# Altium schematic sheet 12_RS485_R232.SchDoc
size 420 x 297 mm; SheetNumber: 12; SheetTotal: 27
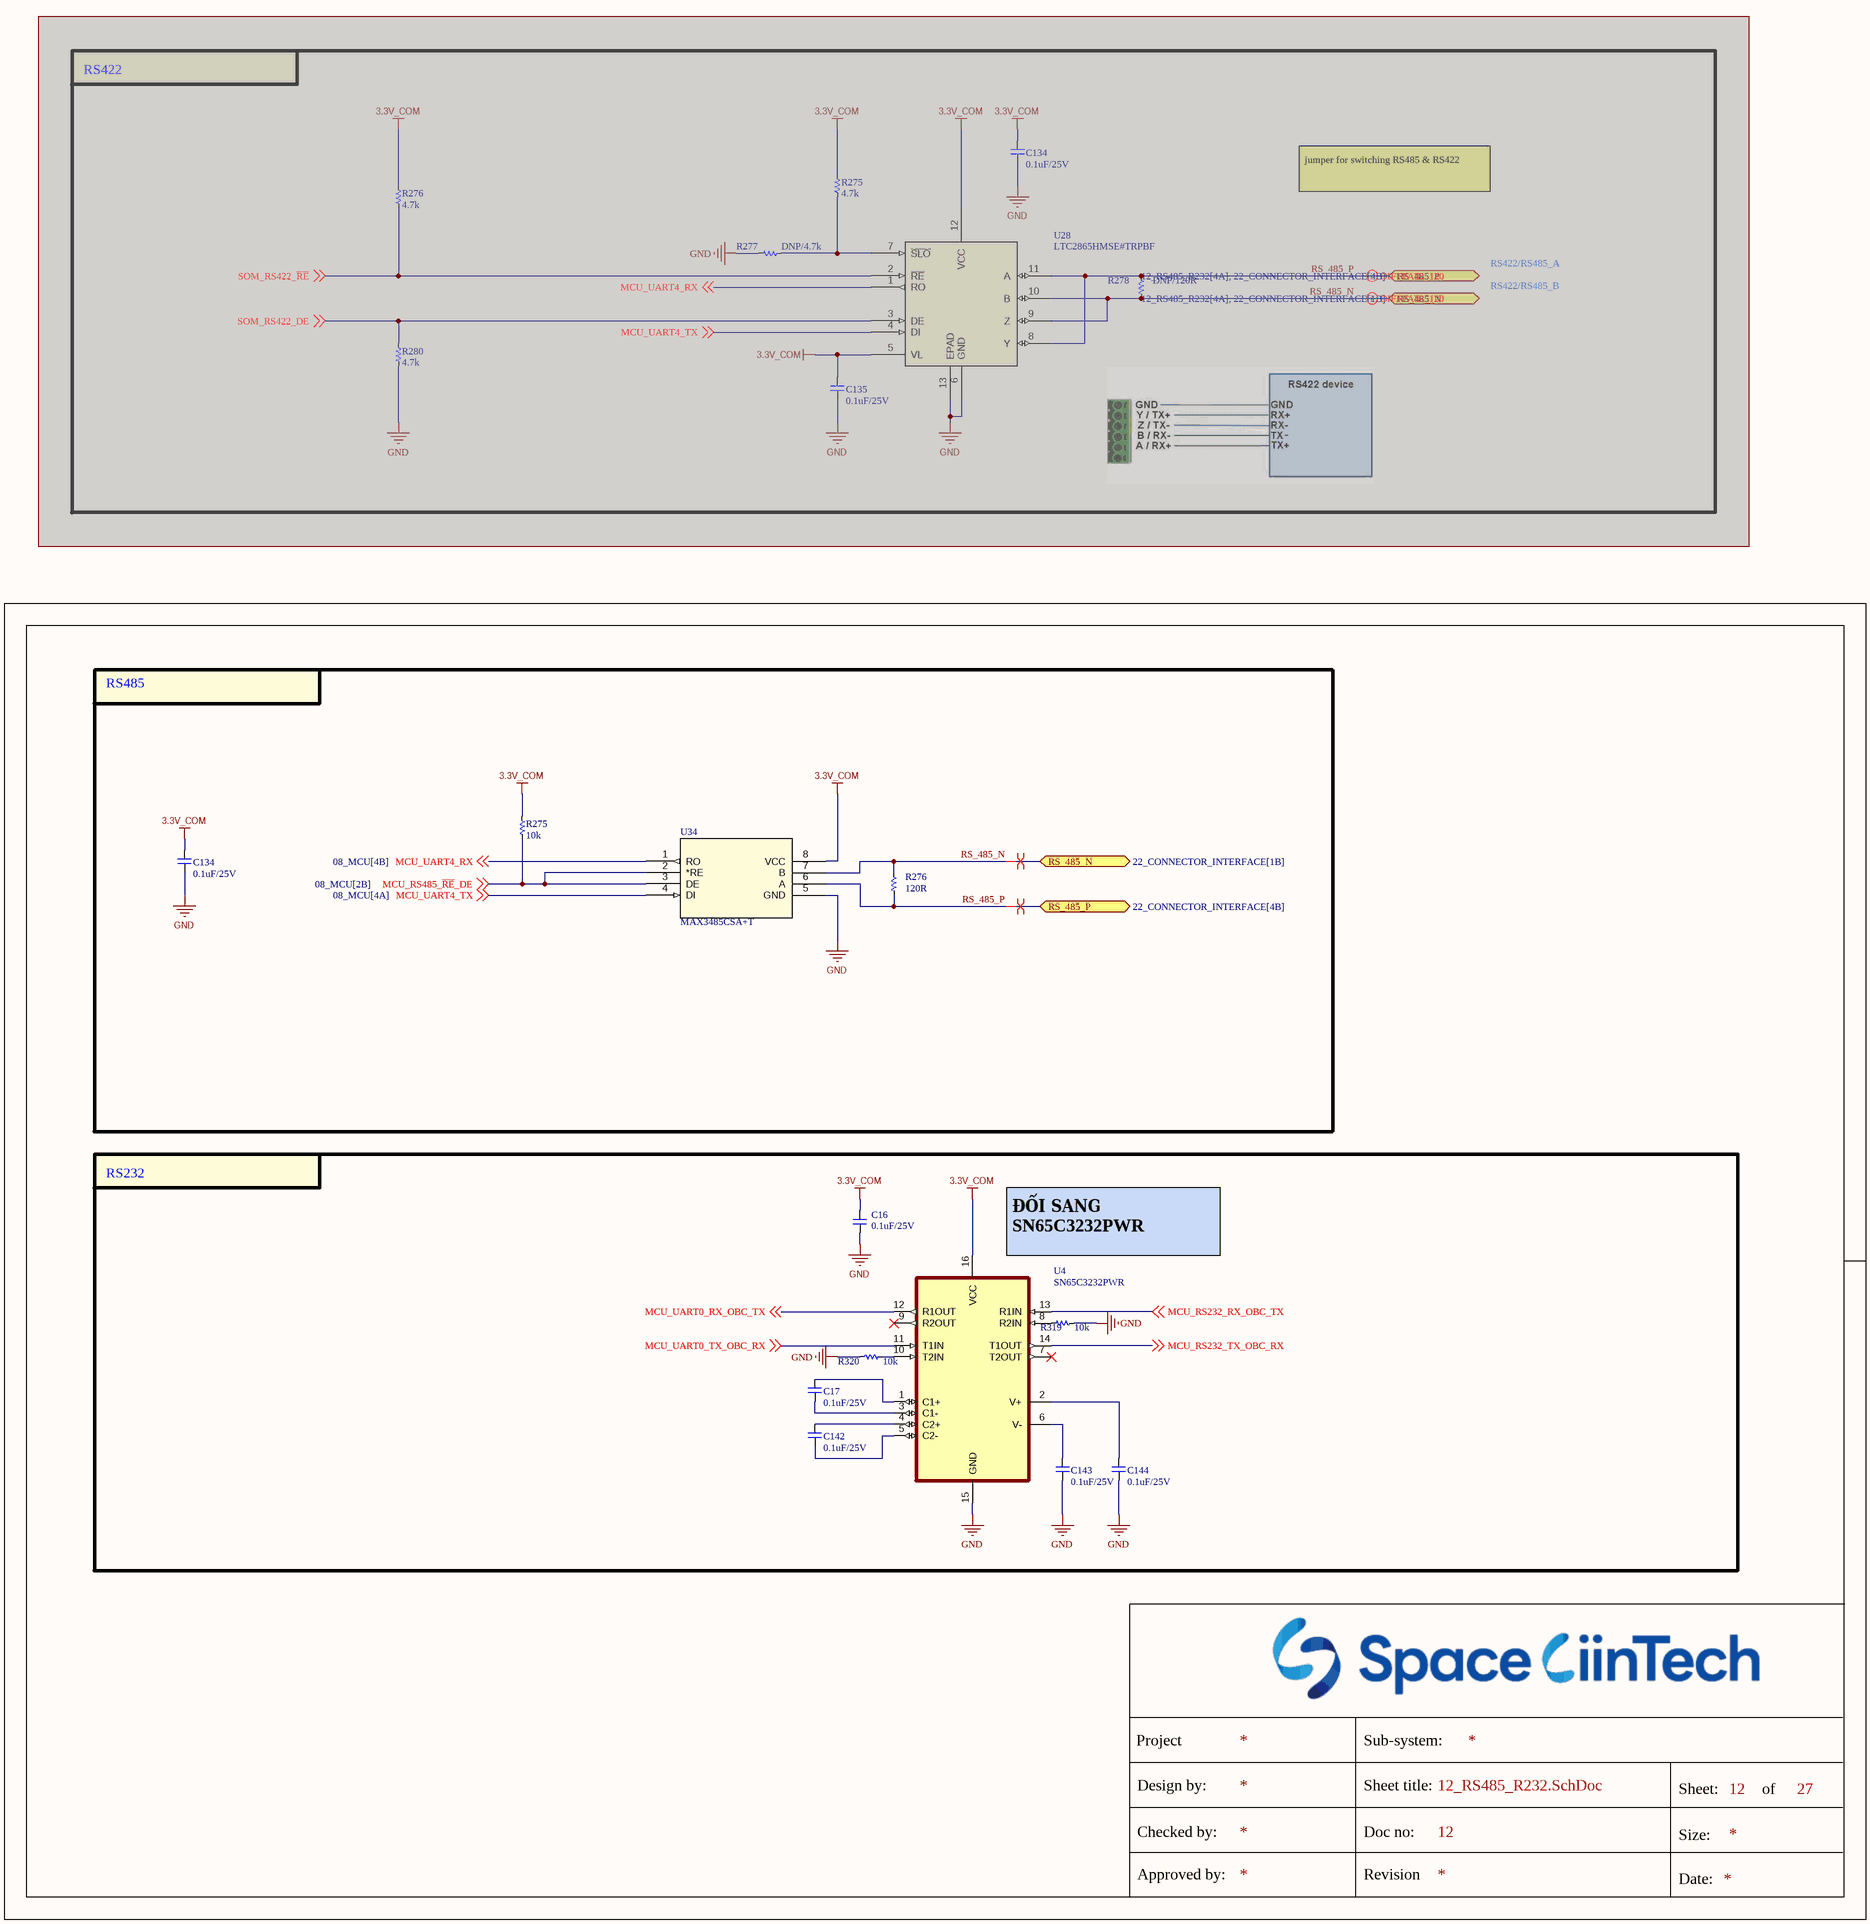
[diagram p0: 12_RS485_R232.SchDoc]

## Parts
(Parts that share a designator on the sheet are numbered #1, #2 ... from top to bottom, then left to right.)
C16  0.1uF/25V  [CAP_C_1608X80]
C17  0.1uF/25V  [CAP_C_1005X60]
C134#1  0.1uF/25V  [CAP_C_1005X60]  (masked out: inside a compile mask, not in the netlist)
C134#2  0.1uF/25V  [CAP_C_1005X60]
C135  0.1uF/25V  [CAP_C_1005X60]  (masked out: inside a compile mask, not in the netlist)
C142  0.1uF/25V  [CAP_C_1005X60]
C143  0.1uF/25V  [CAP_C_1005X60]
C144  0.1uF/25V  [CAP_C_1005X60]
R275#1  4.7k  [RES_C_1005X40]  (masked out: inside a compile mask, not in the netlist)
R275#2  10k  [RES_C_1005X40]
R276#1  4.7k  [RES_C_1005X40]  (masked out: inside a compile mask, not in the netlist)
R276#2  120R  [RES_C_1005X40]
R277  DNP/4.7k  [RES_C_1005X40]  (masked out: inside a compile mask, not in the netlist)
R278  DNP/120R  [RES_C_1005X40]  (masked out: inside a compile mask, not in the netlist)
R280  4.7k  [RES_C_1005X40]  (masked out: inside a compile mask, not in the netlist)
R319  10k  [RES_C_1005X40]
R320  10k  [RES_C_1005X40]
U4  SN65C3232PWR  [SOP65P640X120-16N]
U28  LTC2865HMSE#TRPBF  [MSOP-12_MSE_LIT]  (masked out: inside a compile mask, not in the netlist)
U34  MAX3485CSA+T  [21-0041-3-M_90-0096-8L_MXM]

## Blocks framed on the sheet
RS422: C134#1 C135 R275#1 R276#1 R277 R278 R280 U28
RS485: C134#2 R275#2 R276#2 U34
RS232: C16 C17 C142-C144 R319 R320 U4

## Ports
RS_485_N (bidir, see 12_RS485_R232[4A], 22_CONNECTOR_INTERFACE[1B]), RS_485_N (bidir, see 22_CONNECTOR_INTERFACE[1B]), RS_485_P (bidir, see 12_RS485_R232[4A], 22_CONNECTOR_INTERFACE[4B]), RS_485_P (bidir, see 22_CONNECTOR_INTERFACE[4B])

## Nets
3.3V_COM: C16.2 C134#2.2 R275#2.1 U4.16(VCC) U34.8(VCC)
GND: C16.1 C134#2.1 C143.1 C144.1 R319.1 R320.1 U4.15(GND) U34.5(GND)
MCU_RS232_RX_OBC_TX: U4.13(R1IN) ; off-sheet MCU_RS232_RX_OBC_TX
MCU_RS232_TX_OBC_RX: U4.14(T1OUT) ; off-sheet MCU_RS232_TX_OBC_RX
MCU_RS485_~{RE}_DE: R275#2.2 U34.2(*RE) U34.3(DE) ; off-sheet MCU_RS485_~{RE}_DE
MCU_UART0_RX_OBC_TX: U4.12(R1OUT) ; off-sheet MCU_UART0_RX_OBC_TX
MCU_UART0_TX_OBC_RX: U4.11(T1IN) ; off-sheet MCU_UART0_TX_OBC_RX
MCU_UART4_RX: U34.1(RO) ; off-sheet MCU_UART4_RX
MCU_UART4_TX: U34.4(DI) ; off-sheet MCU_UART4_TX
RS_485_N: R276#2.1 U34.7(B) ; port RS_485_N
RS_485_P: R276#2.2 U34.6(A) ; port RS_485_P
NetC17_1: C17.1 U4.3(C1-)
NetC17_2: C17.2 U4.1(C1+)
NetC142_1: C142.1 U4.5(C2-)
NetC142_2: C142.2 U4.4(C2+)
NetC143_2: C143.2 U4.6(V-)
NetC144_2: C144.2 U4.2(V+)
NetR319_2: R319.2 U4.8(R2IN)
NetR320_2: R320.2 U4.10(T2IN)

Not connected (* = marked no-connect by the designer): U4 7(T2OUT)* 9(R2OUT)*

## Layout directives
differential pair; differential pair class DIFFPAIR_120: (no net found under the mark)
differential pair; differential pair class DIFF90; net class DIFF90; rule Matched Net Lengths [Tolerance = 4mil]: RS_485_N, RS_485_P

## Notes on the sheet
- jumper for switching RS485 & RS422
- RS422/RS485_A
- RS422/RS485_B
- (near U4) ĐỔI SANG SN65C3232PWR
- Project
- Sub-system:
- Design by:
- Sheet title:
- Sheet:
- of
- Checked by:
- Approved by:
- Doc no:
- Revision
- Size:
- Date:

## Library data of the parts
C16 C17 C134#1 C134#2 C135 C142-C144 = _CAP_C_2: CAP
R275#1 R275#2 R276#1 R276#2 R277 R278 R280 R319 R320 = _RES_B_2: RES
U4 = IC_RS232_SN65C3232PWR: 2/2 Transceiver Full RS232 16-TSSOP 1GHz; MF: Analog Devices; MP: MAX3232CSE+T; SnapEDA_Link: https://www.snapeda.com/parts/MAX3232CSE+T/Analog+Devices/view-part/?ref=snap; Package: SOIC-16 Maxim Integrated; Value: *; Check_prices: https://www.snapeda.com/parts/MAX3232CSE+T/Analog+Devices/view-part/?ref=eda
U28 = LTC2865HMSETRPBF: Â±60V Fault Protected 3V to 5.5V RS485/RS422 Transceivers; Manufacturer_Name: Analog Devices Inc; Copyright: Copyright (C) 2025 Ultra Librarian. All rights reserved.; Manufacturer_Part_Number: LTC2865HMSE#TRPBF; RefDes: RefDes; Type: Type
U34 = MAX3485CSA+T: Low-Power, Slew-Rate-Limited RS-485/RS-422 Transceivers, IC TRANSCEIVER HALF 1/1 8SOIC; Manufacturer_Name: Analog Devices Inc; Manufacturer_Part_Number: MAX485CSA+T; Copyright: Copyright (C) 2025 Ultra Librarian. All rights reserved.; RefDes: RefDes; Type: Type